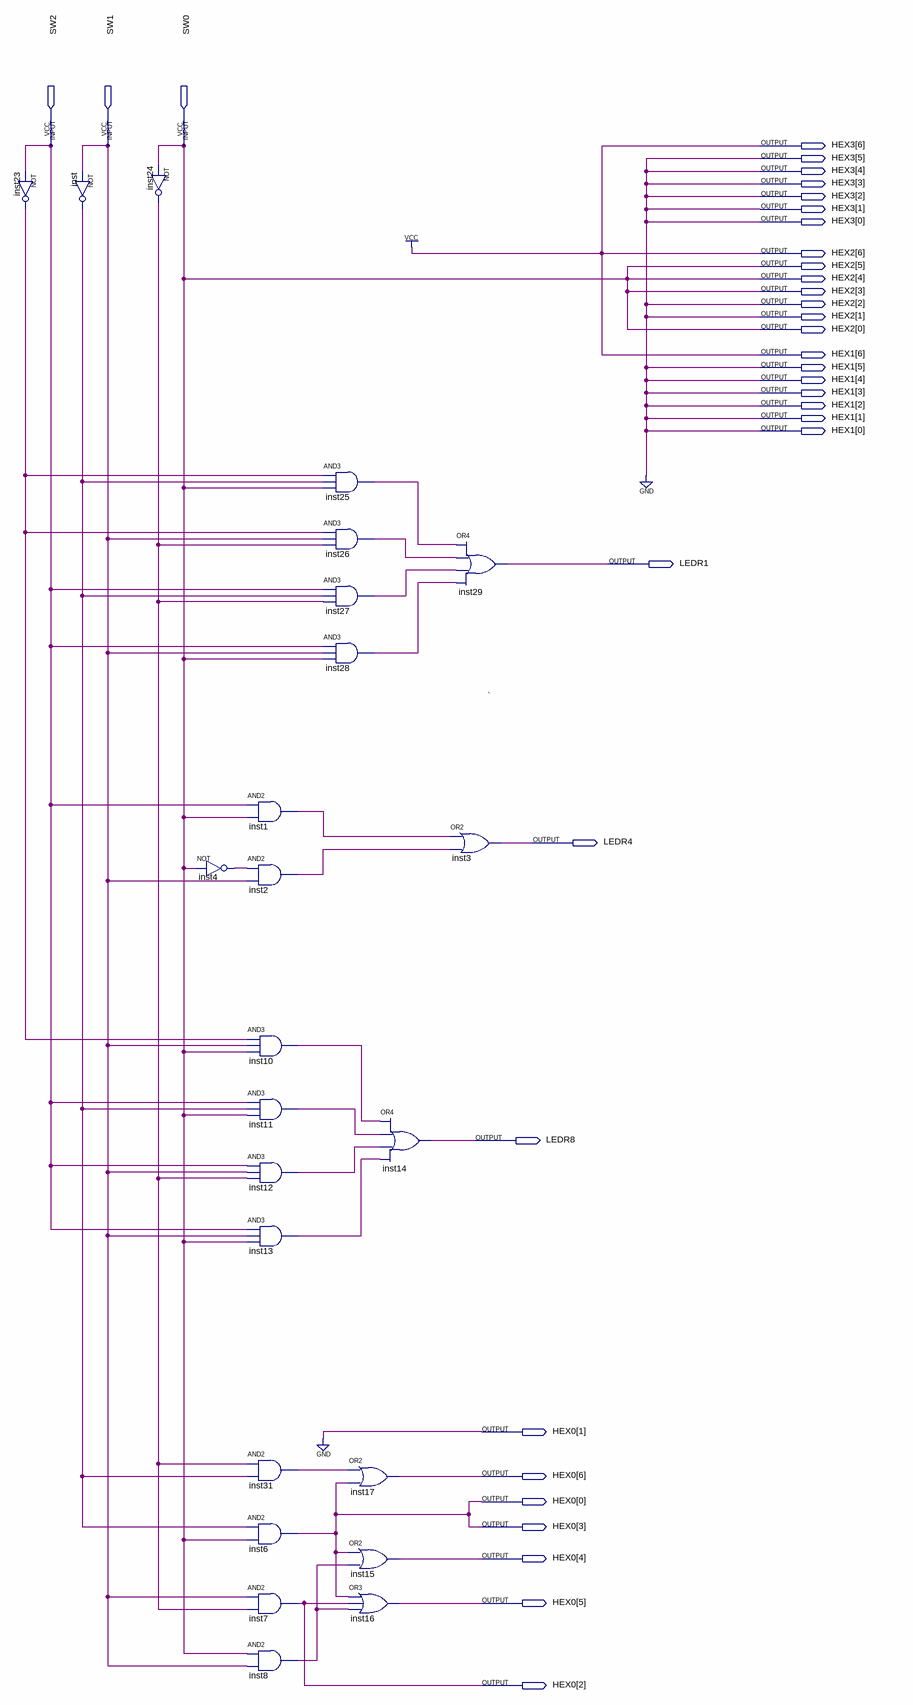
[diagram p0: schematic sheet]
// Quartus schematic L1C010.bdf as structural Verilog: 24 symbols, 34 pins
module L1C010 (
  input  SW2,
  input  SW1,
  input  SW0,
  output [6:0] HEX3,
  output [6:0] HEX2,
  output [6:0] HEX1,
  output LEDR1,
  output LEDR4,
  output LEDR8,
  output [6:0] HEX0
);

  wire inst1_out, inst2_out, inst4_out, inst8_out, inst10_out, inst11_out, inst12_out, inst13_out,
       inst23_out, inst24_out, inst25_out, inst26_out, inst27_out, inst28_out, inst31_out, inst_out;

  not inst23 (inst23_out, SW2);
  not inst (inst_out, SW1);
  not inst24 (inst24_out, SW0);
  not inst4 (inst4_out, SW0);
  and inst1 (inst1_out, SW2, SW0);
  and inst2 (inst2_out, inst4_out, SW1);
  and inst10 (inst10_out, inst23_out, SW1, SW0);
  and inst11 (inst11_out, SW2, inst_out, SW0);
  and inst12 (inst12_out, SW2, SW1, inst24_out);
  and inst13 (inst13_out, SW2, SW1, SW0);
  and inst31 (inst31_out, inst24_out, inst_out);
  and inst6 (HEX0[3], inst_out, SW0);
  and inst7 (HEX0[2], SW1, inst24_out);
  and inst8 (inst8_out, SW0, SW1);
  and inst25 (inst25_out, inst23_out, inst_out, SW0);
  and inst26 (inst26_out, inst23_out, SW1, inst24_out);
  and inst27 (inst27_out, SW2, inst_out, inst24_out);
  and inst28 (inst28_out, SW2, SW1, SW0);
  or inst14 (LEDR8, inst10_out, inst11_out, inst12_out, inst13_out);
  or inst17 (HEX0[6], inst31_out, HEX0[3]);
  or inst15 (HEX0[4], HEX0[3], inst8_out);
  or inst16 (HEX0[5], HEX0[3], HEX0[2], inst8_out);
  or inst29 (LEDR1, inst25_out, inst26_out, inst27_out, inst28_out);
  or inst3 (LEDR4, inst1_out, inst2_out);

  assign HEX0[1:0] = {1'b0, HEX0[3]};
  assign HEX1 = 7'b1000000;
  assign HEX2 = {1'b1, {3{SW0}}, 2'b00, SW0};
  assign HEX3 = 7'b1000000;

  // Notes on the sheet:
  //   `
endmodule
